# Altium schematic sheet PWMExpander.SchDoc: PWM Expander
size 292 x 193 mm; CheckedBy: Łukasz Gójski; CompanyName: Politechnika Warszawska; Organization: EITI; Address1: Nowowiejska 15/19; Address2: 00-665 Warszawa; SheetNumber: 6; SheetTotal: 13; NazwaPliku: PWM expander; FileName: PWM expander; HTTPLink: www.pw.edu.pl
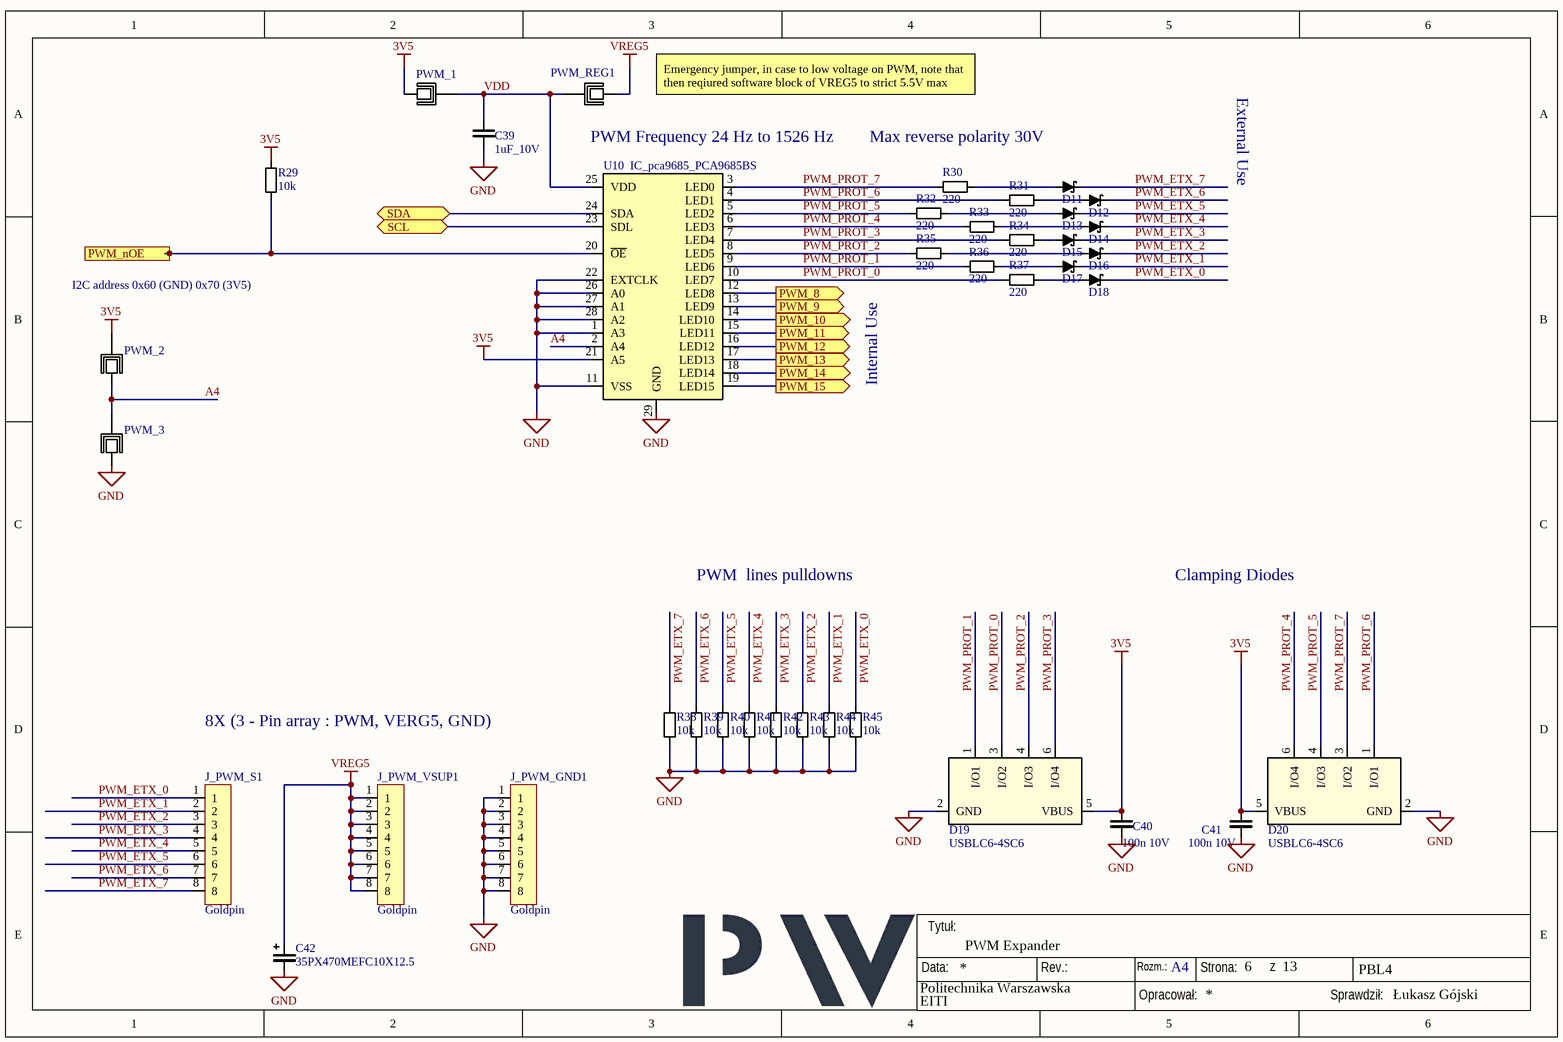
[diagram p0: PWMExpander.SchDoc]

## Parts
C39  1uF_10V  [C_0603]
C40  100n 10V  [C_0603]
C41  100n 10V  [C_0603]
C42  35PX470MEFC10X12.5  [CAP_PKPZ_10X12P5_LOW_RUB]
D11  CUS520,H3F  [SOD2513X115N]  (value not drawn)
D12  CUS520,H3F  [SOD2513X115N]  (value not drawn)
D13  CUS520,H3F  [SOD2513X115N]  (value not drawn)
D14  CUS520,H3F  [SOD2513X115N]  (value not drawn)
D15  CUS520,H3F  [SOD2513X115N]  (value not drawn)
D16  CUS520,H3F  [SOD2513X115N]  (value not drawn)
D17  CUS520,H3F  [SOD2513X115N]  (value not drawn)
D18  CUS520,H3F  [SOD2513X115N]  (value not drawn)
D19  USBLC6-4SC6  [SOT23-6L_STM]
D20  USBLC6-4SC6  [SOT23-6L_STM]
J_PWM_GND1  Goldpin  [goldpin8]
J_PWM_S1  Goldpin  [goldpin8]
J_PWM_VSUP1  Goldpin  [goldpin8]
PWM_1  JUMPER  [Jumper]  (value not drawn)
PWM_2  JUMPER  [Jumper]  (value not drawn)
PWM_3  JUMPER  [Jumper]  (value not drawn)
PWM_REG1  JUMPER  [Jumper]  (value not drawn)
R29  10k  [R_0603]
R30  220  [R_0603]
R31  220  [R_0603]
R32  220  [R_0603]
R33  220  [R_0603]
R34  220  [R_0603]
R35  220  [R_0603]
R36  220  [R_0603]
R37  220  [R_0603]
R38  10k  [R_0603]
R39  10k  [R_0603]
R40  10k  [R_0603]
R41  10k  [R_0603]
R42  10k  [R_0603]
R43  10k  [R_0603]
R44  10k  [R_0603]
R45  10k  [R_0603]
U10  IC_pca9685_PCA9685BS  [PCA9685_SOT788-1]

## Ports
PWM_8 (out, see MainAssembly[4B]), PWM_9 (out, see MainAssembly[4B]), PWM_10 (out, see MainAssembly[4B]), PWM_11 (out, see MainAssembly[4B]), PWM_12 (out, see MainAssembly[4B]), PWM_13 (out, see MainAssembly[4B]), PWM_14 (out, see MainAssembly[4B]), PWM_15 (out, see MainAssembly[4B]), PWM_nOE (in, see MainAssembly[4B]), SCL (bidir, see MainAssembly[3B], ADCHighVoltageInputsSchDoc[2A], DAC[3C], DCDCreg[2C], GPIOExpander[2B], USBPD[4C]), SDA (bidir, see MainAssembly[3B], ADCHighVoltageInputsSchDoc[2A], DAC[3C], DCDCreg[2C], GPIOExpander[2B], USBPD[4C])

## Nets
3V5: C40.2 C41.2 D19.5(VBUS) D20.5(VBUS) PWM_1.1 PWM_2.2 R29.2 U10.21(A5)
GND: C39.1 C40.1 C41.1 C42.2 D19.2(GND) D20.2(GND) J_PWM_GND1.1 J_PWM_GND1.2 J_PWM_GND1.3 J_PWM_GND1.4 J_PWM_GND1.5 J_PWM_GND1.6 J_PWM_GND1.7 J_PWM_GND1.8 PWM_3.1 R38.1 R39.1 R40.1 R41.1 R42.1 R43.1 R44.1 R45.1 U10.1(A3) U10.11(VSS) U10.22(EXTCLK) U10.26(A0) U10.27(A1) U10.28(A2) U10.29(GND)
VREG5: C42.1 J_PWM_VSUP1.1 J_PWM_VSUP1.2 J_PWM_VSUP1.3 J_PWM_VSUP1.4 J_PWM_VSUP1.5 J_PWM_VSUP1.6 J_PWM_VSUP1.7 J_PWM_VSUP1.8 PWM_REG1.1
A4: PWM_2.1 PWM_3.2 U10.2(A4)
PWM_8: U10.12(LED8) ; port PWM_8
PWM_9: U10.13(LED9) ; port PWM_9
PWM_10: U10.14(LED10) ; port PWM_10
PWM_11: U10.15(LED11) ; port PWM_11
PWM_12: U10.16(LED12) ; port PWM_12
PWM_13: U10.17(LED13) ; port PWM_13
PWM_14: U10.18(LED14) ; port PWM_14
PWM_15: U10.19(LED15) ; port PWM_15
PWM_ETX_0: D18.K J_PWM_S1.1 R45.2
PWM_ETX_1: D17.K J_PWM_S1.2 R44.2
PWM_ETX_2: D16.K J_PWM_S1.3 R43.2
PWM_ETX_3: D15.K J_PWM_S1.4 R42.2
PWM_ETX_4: D14.K J_PWM_S1.5 R41.2
PWM_ETX_5: D13.K J_PWM_S1.6 R40.2
PWM_ETX_6: D12.K J_PWM_S1.7 R39.2
PWM_ETX_7: D11.K J_PWM_S1.8 R38.2
PWM_nOE: R29.1 U10.20(~{OE}) ; port PWM_nOE
PWM_PROT_0: D19.3(I/O2) R37.1 U10.10(LED7)
PWM_PROT_1: D19.1(I/O1) R36.1 U10.9(LED6)
PWM_PROT_2: D19.4(I/O3) R35.1 U10.8(LED5)
PWM_PROT_3: D19.6(I/O4) R34.1 U10.7(LED4)
PWM_PROT_4: D20.6(I/O4) R33.1 U10.6(LED3)
PWM_PROT_5: D20.4(I/O3) R32.1 U10.5(LED2)
PWM_PROT_6: D20.1(I/O1) R31.1 U10.4(LED1)
PWM_PROT_7: D20.3(I/O2) R30.1 U10.3(LED0)
SCL: U10.23(SDL) ; port SCL
SDA: U10.24(SDA) ; port SDA
VDD: C39.2 PWM_1.2 PWM_REG1.2 U10.25(VDD)
NetD11_A: D11.A R30.2
NetD12_A: D12.A R31.2
NetD13_A: D13.A R32.2
NetD14_A: D14.A R33.2
NetD15_A: D15.A R34.2
NetD16_A: D16.A R35.2
NetD17_A: D17.A R36.2
NetD18_A: D18.A R37.2

## Notes on the sheet
- (near PWM_REG1) Emergency jumper, in case to low voltage on PWM, note that then reqiured software block of VREG5 to strict 5.5V max
- PWM Frequency 24 Hz to 1526 Hz
- Max reverse polarity 30V
- External Use
- (near PWM_2) I2C address 0x60 (GND) 0x70 (3V5)
- (near R35) Internal Use
- PWM  lines pulldowns
- Clamping Diodes
- 8X (3 - Pin array : PWM, VERG5, GND)
- Data:
- Tytuł:
- Rev.:
- Rozm.:
- A4
- Strona:
- z
- PBL4
- Opracował:
- Sprawdził:

## Library data of the parts
C39 = C_1uF_10V: Ceramic capacitor; Value: 1u; Voltage: 10V; Casing: 0603; Dielectric: X7R; Tolerance: 10%; Technology: Ceramic
C40 C41 = C_100nF_10V: Ceramic capacitor; Casing: 0603; Dielectric: X7R; Tolerance: 10%; Value: 100n; Voltage: 10V; Technology: Ceramic
C42 = C_Pol_470uF_35V: 470 µF 35 V Aluminum Electrolytic Capacitors Radial, Can 2000 Hrs @ 105°C; Manufacturer: Rubycon; Value: 470u; Voltage: 35V; Tolerance: 20%
D11-D18 = D schottky 200mA: Schottky Diode 200mA 30V reverse; Power: 150mW; Casing: SOD-323; VFm: 280mV@10mA; Reverse standoff voltage: 30V
D19 D20 = USBLC6-4SC6: Very low capacitance ESD protection; Manufacturer_Name: STMicroelectronics; Copyright: Copyright (C) 2025 Ultra Librarian. All rights reserved.; Manufacturer_Part_Number: USBLC6-4SC6; RefDes: RefDes; Type: Type
J_PWM_GND1 J_PWM_S1 J_PWM_VSUP1 = Goldpin_array_8: Goldpin Male 8
PWM_1-PWM_3 PWM_REG1 = Jumper x2: Jumper on traces
R29 R38-R45 = R_10k: Resistor; Tolerance: 1%; Power: 100mW; Casing: 0603; Value: 10k
R30-R37 = R_220R: Resistor; Tolerance: 1%; Power: 100mW; Casing: 0603; Value: 220